# EasyEDA schematic EasyEDA_SCH-PicoPET_2021-11-24.json
TITLE: PicoPET (Hammond casing); REV: 1.0; Date: 2021-11-14; Sheet: 1/1; Drawn By: .md; Company: Rarach Time
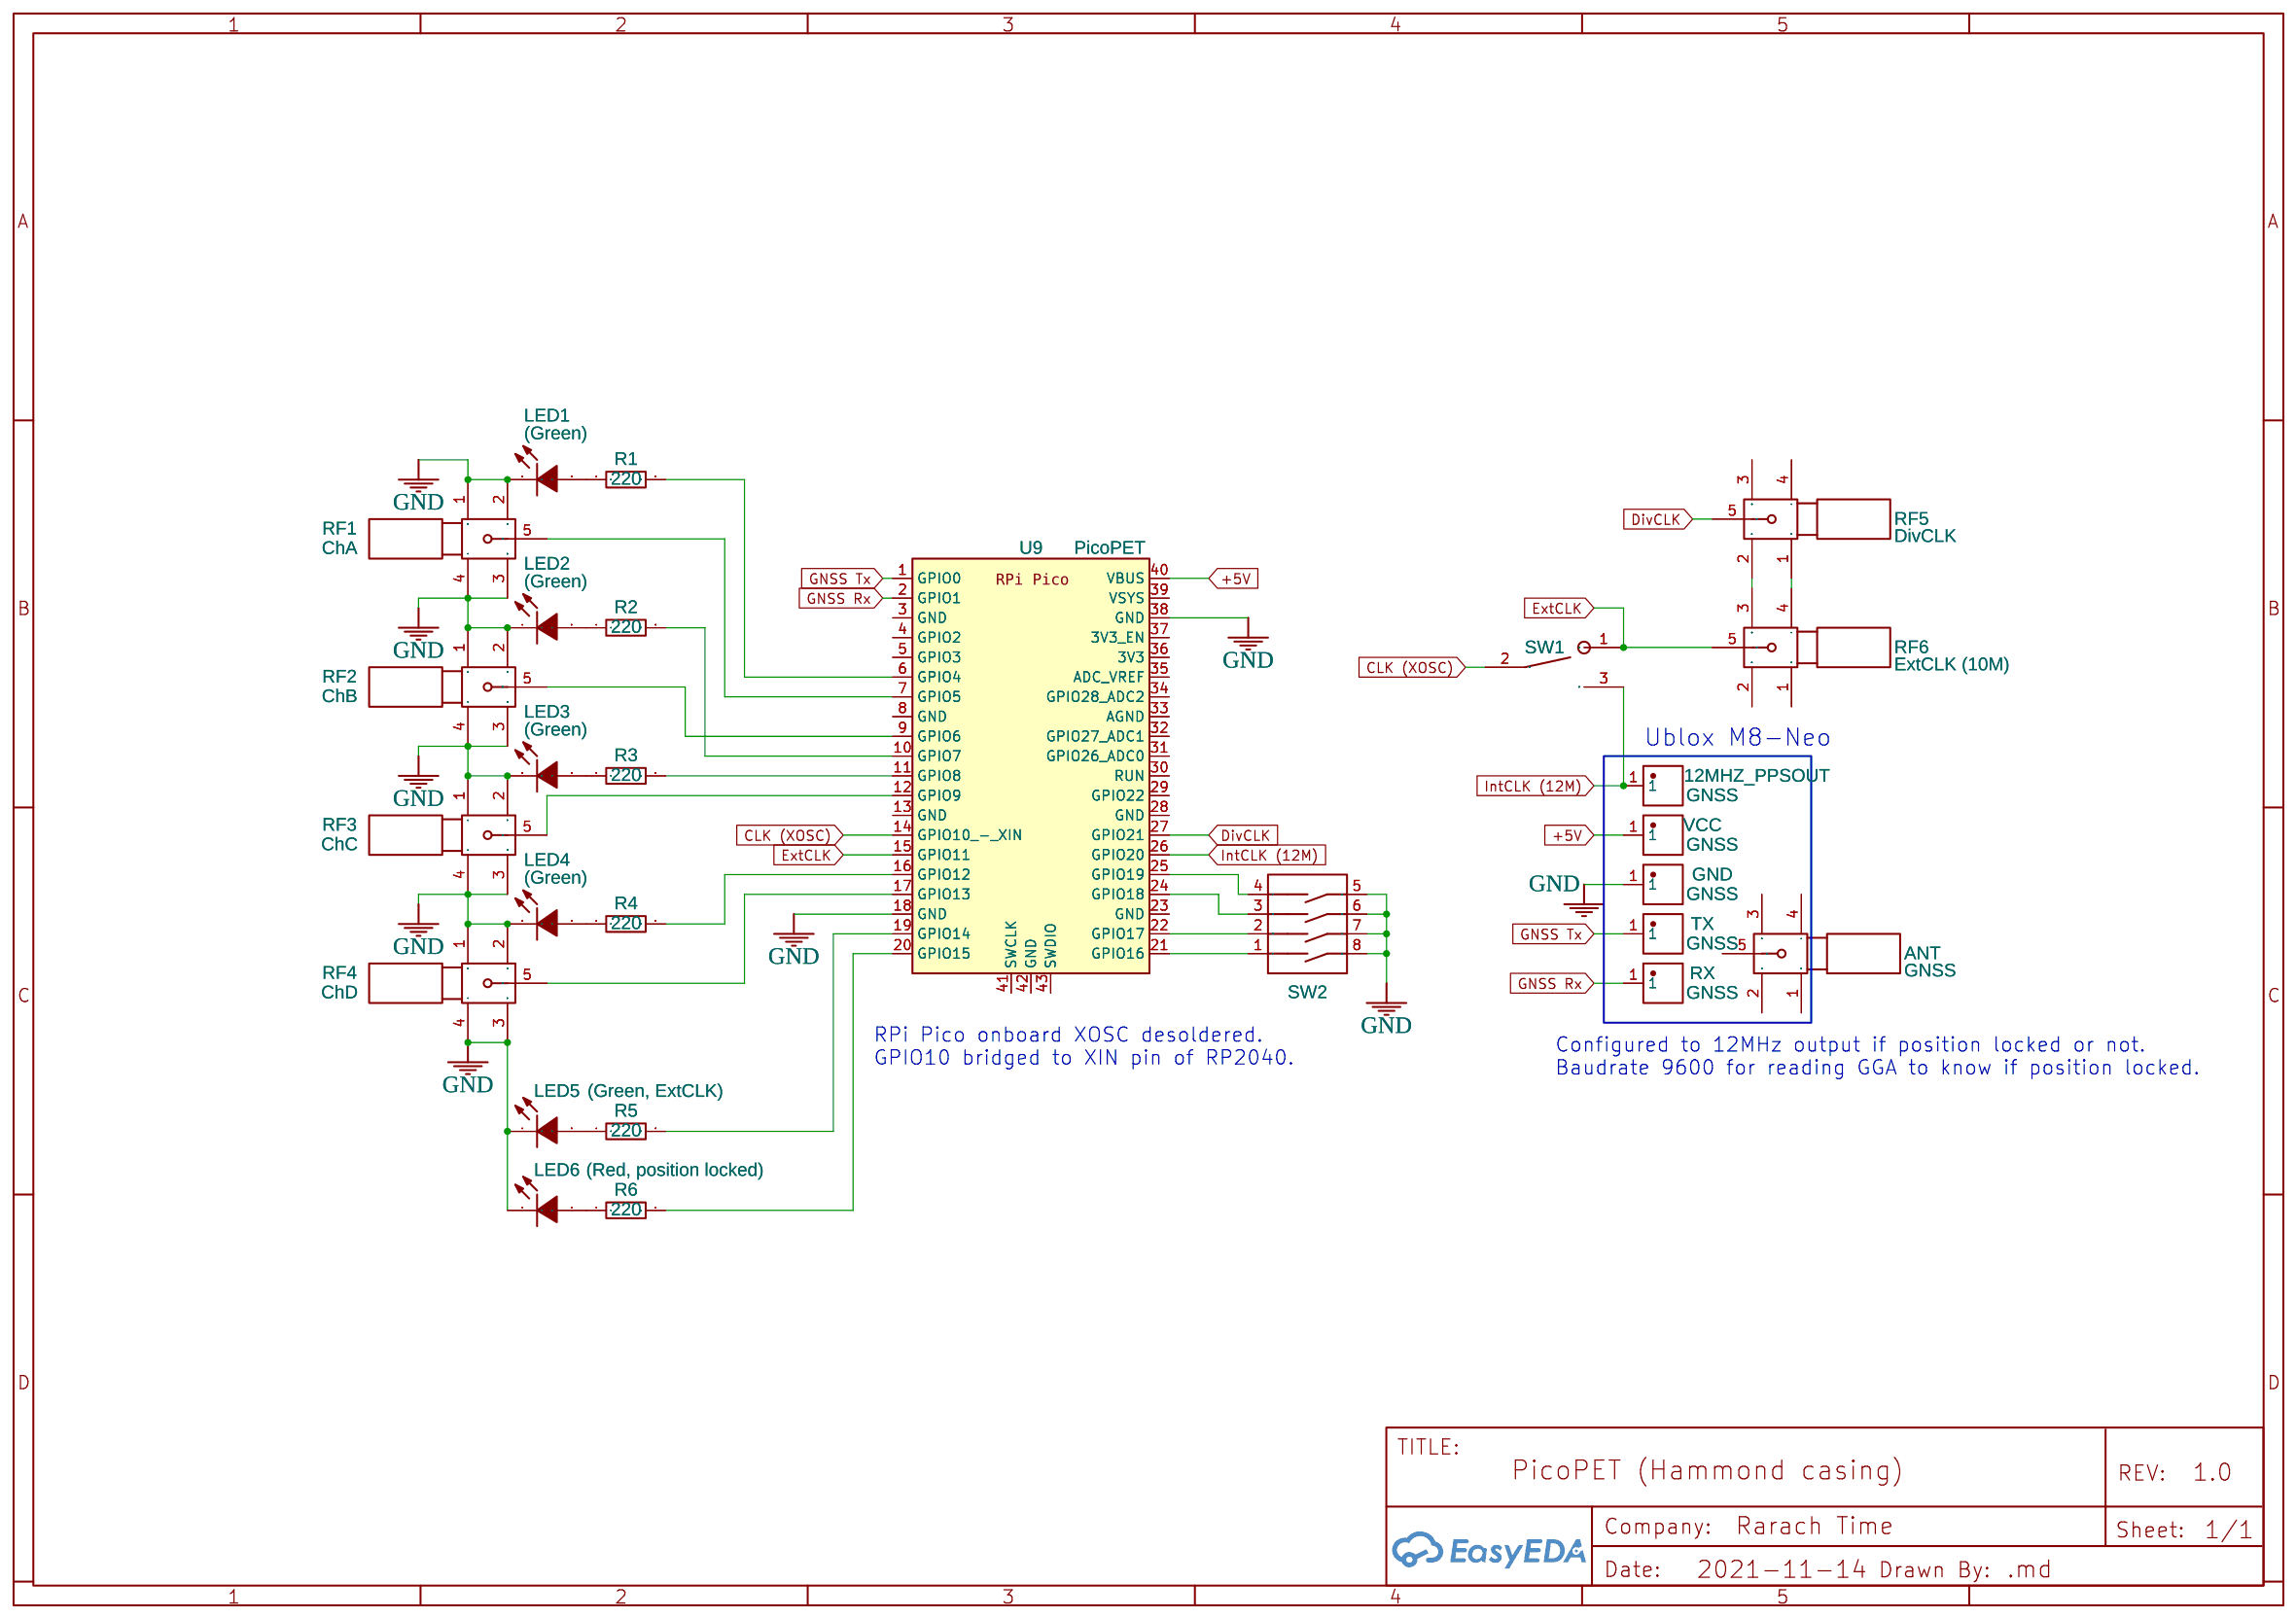
[diagram p0: schematic sheet]

## Parts
12MHZ_PPSOUT  GNSS  [CONN-SMD_L3.2-1.6]
ANT  GNSS  [SMA-SMD_BWSMA-KE-P001]
GND  GNSS  [CONN-SMD_L3.2-1.6]
LED1  (Green)  [LED0805-RD_GREEN]
LED2  (Green)  [LED0805-RD_GREEN]
LED3  (Green)  [LED0805-RD_GREEN]
LED4  (Green)  [LED0805-RD_GREEN]
LED5  (Green, ExtCLK)  [LED0805-RD_GREEN]
LED6  (Red, position locked)  [LED0805-RD_GREEN]
R1  220  [R0805]
R2  220  [R0805]
R3  220  [R0805]
R4  220  [R0805]
R5  220  [R0805]
R6  220  [R0805]
RF1  ChA  [SMA-SMD_BWSMA-KE-P001]
RF2  ChB  [SMA-SMD_BWSMA-KE-P001]
RF3  ChC  [SMA-SMD_BWSMA-KE-P001]
RF4  ChD  [SMA-SMD_BWSMA-KE-P001]
RF5  DivCLK  [SMA-SMD_BWSMA-KE-P001]
RF6  ExtCLK (10M)  [SMA-SMD_BWSMA-KE-P001]
RX  GNSS  [CONN-SMD_L3.2-1.6]
SW1  100SP4T1B4M2QE  [SW-TH_100SP4T1B4M2QE]
SW2  HAD-04H-R  [SW-SMD_HAD-04H-R]
TX  GNSS  [CONN-SMD_L3.2-1.6]
U9  PicoPET  [RPI_PICO_SMD_TH]
VCC  GNSS  [CONN-SMD_L3.2-1.6]

## Library data of the parts
12MHZ_PPSOUT GND RX TX VCC = RCSCTE: Supplier: LCSC; Supplier Part: C159866; Manufacturer: KOA; Contributor: LCSC
ANT RF1-RF6 = BWSMA-KE-P001: Supplier: LCSC; Supplier Part: C496550; Manufacturer: BAT WIRELESS; Contributor: LCSC; JLCPCB Part Class: Extended Part
LED1-LED6 = 0805G (Green): Supplier: LCSC; Manufacturer: KENTO; Supplier Part: C2297; JLCPCB Part Class: Basic Part
R1-R6 = 0805W8F2200T5E: Supplier: LCSC; Manufacturer: UniOhm; Supplier Part: C17557; JLCPCB Part Class: Basic Part
SW1 = 100SP4T1B4M2QE: Supplier: LCSC; Supplier Part: C273358; Manufacturer: E-Switch; Contributor: LCSC; JLCPCB Part Class: Extended Part
SW2 = HAD-04H-R: Supplier: LCSC; Manufacturer: ReliaPro; Manufacturer Part: HAD-04H-R DIP switch; Supplier Part: C3693; JLCPCB Part Class: Extended Part
U9 = Pico: Contributor: Alexey Gumenchuk

## Nets
+5V: U9.40(VBUS) VCC.1
GND: GND.1 LED1.1(K) LED2.1(K) LED3.1(K) LED4.1(K) LED5.1(K) LED6.1(K) RF1.1 RF1.2 RF1.3 RF1.4 RF2.1 RF2.2 RF2.3 RF2.4 RF3.1 RF3.2 RF3.3 RF3.4 RF4.1 RF4.2 RF4.3 RF4.4 SW2.5 SW2.6 SW2.7 SW2.8 U9.18(GND) U9.38(GND)
CLK (XOSC): SW1.2 U9.14(GPIO10 - XIN)
DivCLK: RF5.5 U9.27(GPIO21)
ExtCLK: RF6.5 SW1.1 U9.15(GPIO11)
GNSS Rx: RX.1 U9.2(GPIO1)
GNSS Tx: TX.1 U9.1(GPIO0)
IntCLK (12M): 12MHZ_PPSOUT.1 SW1.3 U9.26(GPIO20)
Net-(LED1-2): LED1.2(A) R1.1
Net-(LED2-2): LED2.2(A) R2.1
Net-(LED3-2): LED3.2(A) R3.1
Net-(LED4-2): LED4.2(A) R4.1
Net-(LED5-2): LED5.2(A) R5.1
Net-(LED6-2): LED6.2(A) R6.1
Net-(R1-2): R1.2 U9.6(GPIO4)
Net-(R2-2): R2.2 U9.10(GPIO7)
Net-(R3-2): R3.2 U9.11(GPIO8)
Net-(R4-2): R4.2 U9.16(GPIO12)
Net-(R5-2): R5.2 U9.19(GPIO14)
Net-(R6-2): R6.2 U9.20(GPIO15)
Net-(RF1-5): RF1.5 U9.7(GPIO5)
Net-(RF2-5): RF2.5 U9.9(GPIO6)
Net-(RF3-5): RF3.5 U9.12(GPIO9)
Net-(RF4-5): RF4.5 U9.17(GPIO13)
Net-(RF5-1): RF5.1 RF6.4
Net-(RF5-2): RF5.2 RF6.3
Net-(SW2-1): SW2.1 U9.21(GPIO16)
Net-(SW2-2): SW2.2 U9.22(GPIO17)
Net-(SW2-3): SW2.3 U9.24(GPIO18)
Net-(SW2-4): SW2.4 U9.25(GPIO19)

Not connected (* = marked no-connect by the designer): ANT 1 2 3 4 5; RF5 3 4; RF6 1 2; U9 3(GND) 4(GPIO2) 5(GPIO3) 8(GND) 13(GND) 23(GND) 28(GND) 29(GPIO22) 30(RUN) 31(GPIO26_ADC0) 32(GPIO27_ADC1) 33(AGND) 34(GPIO28_ADC2) 35(ADC_VREF) 36(3V3) 37(3V3_EN) 39(VSYS) 41(SWCLK) 42(GND) 43(SWDIO)

## Notes on the sheet
- Ublox M8-Neo
- RPi Pico onboard XOSC desoldered.
  GPIO10 bridged to XIN pin of RP2040.
- Configured to 12MHz output if position locked or not.
  Baudrate 9600 for reading GGA to know if position locked.
